# Altium project TIDA_00620.PrjPcb (part 4 of 8)
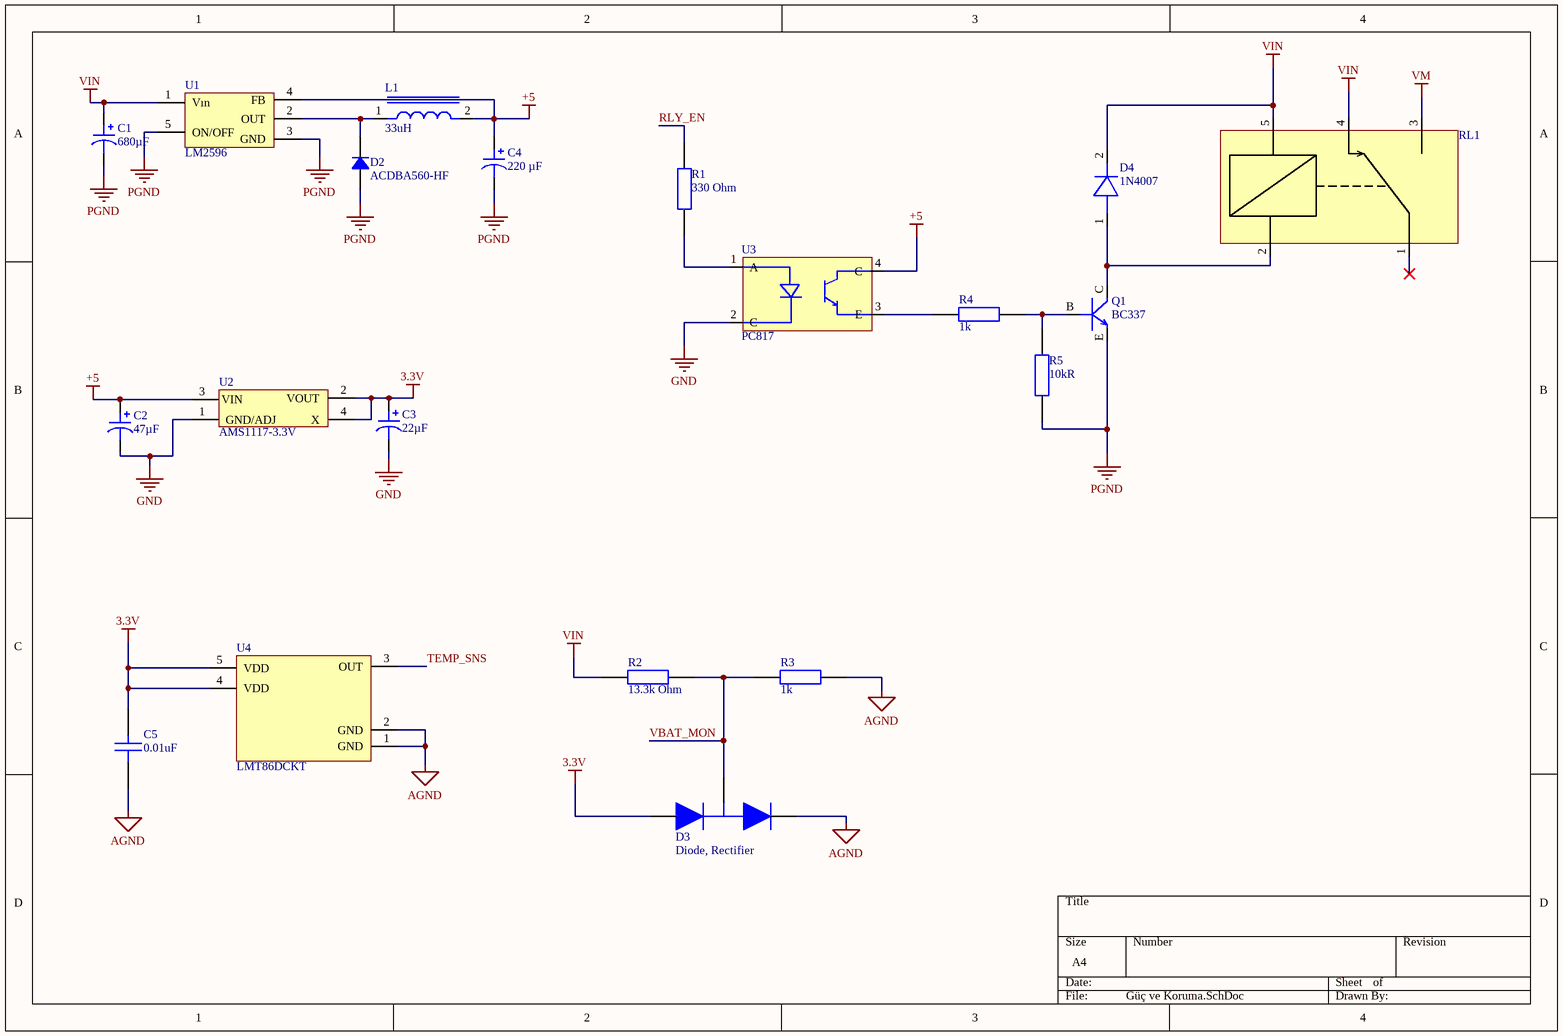
[diagram p7: Güç ve Koruma.SchDoc]

## Sheet Güç ve Koruma.SchDoc (continued)
### Library data of the parts
C1 = EEU-FC1H681L: CAP ALUM 680UF 20% 50V RADIAL; manufacturer: Panasonic Electronic Components; Impedance: 40 mOhms; Lifetime @ Temp.: 5000 Hrs @ 105°C; Polarization: Polar; Ripple Current @ High Frequency: 2.215A @ 100kHz; Ripple Current @ Low Frequency: 1.661A @ 120Hz; Part Number: EEU-FC1H681L; Applications: Automotive; Capacitance: 680µF; componentlink1description: Datasheet; componentlink1url: http://industrial.panasonic.com/www-cgi/jvcr13pz.cgi?E+PZ+3+ABA0022+EEUFC1H681L+7+WW; componentlink2description: DigiKey Link; componentlink2url: http://digikey.com/product-detail/en/panasonic-electronic-components/EEU-FC1H681L/P10330-ND/266339; Device Package: Radial, Can; Height - Seated (Max): 1.181" (30.00mm); lastupdated: 2.09.2020 01:32:17; Lead Spacing: 0.197" (5.00mm); Lifecycle Status: Active; Minimum Order: 1; Mounting Type: Through Hole; Operating Temperature: -55°C ~ 105°C; Package / Case: Radial, Can; packaging: Bulk; partid: 15369; Part Status: Active; price: 1.02; Ratings: AEC-Q200; series: FC; Size / Dimension: 0.492" Dia (12.50mm); Supplier 1: DigiKey; Supplier Part Number 1: P10330-ND; Tolerance: ±20%; value: 680µF; Voltage - Rated: 50V
C2 = UMF1C470MDD: CAP ALUM 47UF 20% 16V RADIAL; manufacturer: Nichicon; Impedance: 1.3 Ohms; Lifetime @ Temp.: 1000 Hrs @ 105°C; Polarization: Polar; Ripple Current @ High Frequency: 115mA @ 100kHz; Ripple Current @ Low Frequency: 57.5mA @ 120Hz; Part Number: UMF1C470MDD; Applications: General Purpose; Capacitance: 47µF; componentlink1description: Datasheet; componentlink1url: http://nichicon-us.com/english/products/pdfs/e-umf.pdf; componentlink2description: DigiKey Link; componentlink2url: http://digikey.com/product-detail/en/nichicon/UMF1C470MDD/493-15537-ND/2598659; Device Package: Radial, Can; Height - Seated (Max): 0.236" (6.00mm); lastupdated: 4.09.2020 01:05:49; Lead Spacing: 0.098" (2.50mm); Lifecycle Status: Active; Minimum Order: 1; Mounting Type: Through Hole; Operating Temperature: -55°C ~ 105°C; Package / Case: Radial, Can; packaging: Bulk; partid: 20736; Part Status: Active; price: 0.43; series: UMF; Size / Dimension: 0.248" Dia (6.30mm); Supplier 1: DigiKey; Supplier Part Number 1: 493-15537-ND; Tolerance: ±20%; value: 47µF; Voltage - Rated: 16V
C3 = UES1C220MEM1TD: CAP ALUM 22UF 20% 16V RADIAL; manufacturer: Nichicon; Lifetime @ Temp.: 1000 Hrs @ 85°C; Polarization: Bi-Polar; Part Number: UES1C220MEM1TD; Applications: Audio; Capacitance: 22µF; componentlink1description: Datasheet; componentlink1url: http://nichicon-us.com/english/products/pdfs/e-ues.pdf; componentlink2description: DigiKey Link; componentlink2url: http://digikey.com/product-detail/en/nichicon/UES1C220MEM1TD/493-10818-1-ND/4317793; Device Package: Radial, Can; Height - Seated (Max): 0.472" (12.00mm); lastupdated: 4.09.2020 01:05:44; Lead Spacing: 0.098" (2.50mm); Lifecycle Status: Active; Minimum Order: 1; Mounting Type: Through Hole; Operating Temperature: -40°C ~ 85°C; Package / Case: Radial, Can; packaging: TapeAndBox; partid: 20107; Part Status: Active; price: 0.13; series: UES; Size / Dimension: 0.248" Dia (6.30mm); Supplier 1: DigiKey; Supplier Part Number 1: 493-10818-1-ND; Tolerance: ±20%; value: 22µF; Voltage - Rated: 16V
C4 = ESW227M025AG3AA: CAP ALUM 220UF 20% 25V RADIAL; manufacturer: KEMET; ESR (Equivalent Series Resistance): 130mOhm @ 100kHz; Impedance: 117 mOhms; Lifetime @ Temp.: 4000 Hrs @ 105°C; Polarization: Polar; Ripple Current @ High Frequency: 640 mA @ 100 kHz; Ripple Current @ Low Frequency: 320 mA @ 120 Hz; Part Number: ESW227M025AG3AA; Applications: General Purpose; Capacitance: 220 µF; componentlink1description: Datasheet; componentlink1url: https://api.kemet.com/component-edge/download/datasheet/ESW227M025AG3AA.pdf; componentlink2description: DigiKey Link; componentlink2url: https://www.digikey.com/en/products/detail/kemet/ESW227M025AG3AA/2712542; Device Package: Radial, Can; Height - Seated (Max): 0.492" (12.50mm); lastupdated: 3.06.2024 20:06:12; Lead Spacing: 0.138" (3.50mm); Lifecycle Status: Active; Minimum Order: 1; Mounting Type: Through Hole; Operating Temperature: -40°C ~ 105°C; Package / Case: Radial, Can; packaging: Bulk; partid: 7223; Part Status: Active; price: 0.10; series: ESW; Size / Dimension: 0.315" Dia (8.00mm); Supplier 1: DigiKey; Supplier Part Number 1: 399-6112-ND; Tolerance: ±20%; value: 220 µF; Voltage - Rated: 25 V
C5 = GRM188R70J103KA01D: CAP CER 10000PF 6.3V X7R 0603; Manufacturer: Murata; Tolerance: ±10%; Capacitance: 10000 pF; Voltage - Rated: 6.3V; Package / Case: 0603 (1608 Metric)
D2 = ACDBA560-HF: DIODE SCHOTTKY 60V 5A DO214AC; Manufacturer: Comchip Technology; Capacitance @ Vr, F: 250pF @ 4V, 1MHz; Current - Reverse Leakage @ Vr: 500 µA @ 60 V; Speed: Fast Recovery =< 500ns, > 200mA (Io); Voltage - Forward (Vf) (Max) @ If: 700 mV @ 5 A; Part Number: ACDBA560-HF; ComponentLink1Description: Datasheet; ComponentLink1URL: http://www.comchiptech.com/admin/files/product/ACDBA560-HF%20RevA201382.pdf; ComponentLink2Description: DigiKey Link; ComponentLink2URL: https://www.digikey.com/en/products/detail/comchip-technology/ACDBA560-HF/7100903; Current - Average Rectified (Io): 5A; Diode Type: Schottky; LastUpdated: 3.06.2024 19:54:37; Lifecycle Status: Active; Minimum Order: 1; Mounting Type: Surface Mount; Operating Temperature - Junction: -55°C ~ 125°C; Package / Case: DO-214AC, SMA; Packaging: TapeAndReel; PartId: 1832; Part Status: Active; Price: 0.15; Series: -; Supplier 1: DigiKey; Supplier Part Number 1: 641-2078-1-ND; Supplier Device Package: DO-214AC (SMA); Voltage - DC Reverse (Vr) (Max): 60 V
D3 = MMBD7000LT1G: Diode, Rectifier, Switching, Vr 100VDC, If 200MA, Pkg SOT-23 (TO-236AB), Config Dual; Manufacturer: onsemi; Manufacturer Lifecycle Status: ACTIVE; Value: 1.5pF; Element Configuration: Common Cathode; Forward Voltage: 1.1V; Max Forward Surge Current (Ifsm): 1.6A; Max Junction Temperature (Tj): 150°C; Max Power Dissipation: 225mW; Max Repetitive Reverse Voltage (Vrrm): 100V; Max Reverse Leakage Current: 3µA; Max Surge Current: 500mA; Number of Elements: 2; Power Dissipation: 300mW; Recovery Time: 4ns; Supplier: Future Electronics; Supplier Part Number: 9072660; Manufacturer Part Number: MMBD7000LT1G; RoHS: Compliant; Category: Rectifier Diodes; Stock: 3288000; Pricing: 3000=0,017, 9000=0,0166, 15000=0,0164, 60000=0,0159, 90000=0,0156 (USD); Average Rectified Current: 200mA; Case/Package: SOT-23; China RoHS: Compliant; Contact Plating: Tin; Current Rating: 200mA; Forward Current: 200mA; Halogen Free: Halogen Free; Height: 1.11mm; Lead Free: Lead Free; Length: 2.9mm; Lifecycle Status: Production; Max Operating Temperature: 150°C; Max Output current: 200mA; Max Reverse Voltage (DC): 100V; Min Operating Temperature: -55°C; Pins: 3; Number of Terminals: 3; Packaging: Tape and Reel; Peak Non-Repetitive Surge Current: 500mA; Peak Reverse Current: 3µA; Radiation Hardening: No; REACH SVHC: Yes; Reverse Recovery Time: 4ns; Reverse Standoff Voltage: 100V; Reverse Voltage: 100V; Schedule B: 8541100070, 8541100070|8541100070|8541100070|8541100070|8541100070; Voltage Rating (DC): 100V; Width: 1.3mm; ComponentLink1URL: https://datasheet.octopart.com:443/MMBD7000LT1G-onsemi-datasheet-180963513.pdf?src-supplier=IHS; ComponentLink1Description: https://datasheet.octopart.com:443/MMBD7000LT1G-onsemi-datasheet-180963513.pdf?src-supplier=IHS; ComponentLink2URL: https://datasheet.octopart.com:443/MMBD7000LT1G-ON-Semiconductor-datasheet-93401931.pdf?src-supplier=Newark; ComponentLink2Description: https://datasheet.octopart.com:443/MMBD7000LT1G-ON-Semiconductor-datasheet-93401931.pdf?src-supplier=Newark; ComponentLink3URL: https://datasheet.octopart.com:443/MMBD7000LT1G-ON-Semiconductor-datasheet-11974380.pdf?src-supplier=Newark; ComponentLink3Description: https://datasheet.octopart.com:443/MMBD7000LT1G-ON-Semiconductor-datasheet-11974380.pdf?src-supplier=Newark; ComponentLink4URL: https://datasheet.octopart.com:443/MMBD7000LT1G-ON-Semiconductor-datasheet-8327385.pdf?src-supplier=Newark; ComponentLink4Description: https://datasheet.octopart.com:443/MMBD7000LT1G-ON-Semiconductor-datasheet-8327385.pdf?src-supplier=Newark; ComponentLink5URL: https://datasheet.octopart.com:443/MMBD7000LT1G-ON-Semiconductor-datasheet-7594318.pdf?src-supplier=Newark; ComponentLink5Description: https://datasheet.octopart.com:443/MMBD7000LT1G-ON-Semiconductor-datasheet-7594318.pdf?src-supplier=Newark; ComponentLink6URL: https://sigma.octopart.com:443/138897241/technical_drawing/ON-Semiconductor-MMBD7000LT1G.pdf?src-supplier=Upverter; ComponentLink6Description: https://sigma.octopart.com:443/138897241/technical_drawing/ON-Semiconductor-MMBD7000LT1G.pdf?src-supplier=Upverter; ComponentLink7URL: https://datasheet.octopart.com:443/MMBD7000LT1G-ON-Semiconductor-datasheet-14052313.pdf?src-supplier=iiiC; ComponentLink7Description: https://datasheet.octopart.com:443/MMBD7000LT1G-ON-Semiconductor-datasheet-14052313.pdf?src-supplier=iiiC; ComponentLink8URL: https://datasheet.octopart.com:443/MMBD7000LT1G-ON-Semiconductor-datasheet-9951378.pdf?src-supplier=RS+(Formerly+Allied+Electronics); ComponentLink8Description: https://datasheet.octopart.com:443/MMBD7000LT1G-ON-Semiconductor-datasheet-9951378.pdf?src-supplier=RS+(Formerly+Allied+Electronics); ComponentLink9URL: http://sigma.octopart.com:80/15540786/rohs_certificate/ON-Semiconductor-MMBD7000LT1G.pdf?src-supplier=Compliance+Statements; ComponentLink9Description: http://sigma.octopart.com:80/15540786/rohs_certificate/ON-Semiconductor-MMBD7000LT1G.pdf?src-supplier=Compliance+Statements; ComponentLink10URL: http://sigma.octopart.com:80/15680733/materials_sheet/ON-Semiconductor-MMBD7000LT1G.csv?src-supplier=Compliance+Statements; ComponentLink10Description: http://sigma.octopart.com:80/15680733/materials_sheet/ON-Semiconductor-MMBD7000LT1G.csv?src-supplier=Compliance+Statements; ComponentLink11URL: http://sigma.octopart.com:80/150618295/rohs_statement/ON-Semiconductor-MMBD7000LT1G.pdf?src-supplier=Compliance+Statements; ComponentLink11Description: http://sigma.octopart.com:80/150618295/rohs_statement/ON-Semiconductor-MMBD7000LT1G.pdf?src-supplier=Compliance+Statements; ComponentLink12URL: http://sigma.octopart.com:80/reach_statement/ON-Semiconductor-company-79.pdf?src-supplier=Compliance+Statements; ComponentLink12Description: http://sigma.octopart.com:80/reach_statement/ON-Semiconductor-company-79.pdf?src-supplier=Compliance+Statements; ComponentLink13URL: https://octopart.com:443/opatz8j6/c1?t=fJzi0fIB4MdtCKTN66uwhwNTDQrl0R6yc-1-o3J3PffONZWqkIMU2L6fpiOR1oZSET9f3sqQd7ykmPSoW81IbVPyVBFwBUdoF7sQArq84QgRXK9HCf9McP42Xxbn8aEVplU8K_KhDjglBkkd9-zc6p6-CJ9lKtUv1E-pLWoCkW-rqVYkDrRqY25a9IANyKSZPTXd9uYNFNsED4muOrsd3TsRENCZ-qK4VhaX_vUYcK9Gw4t3xLVeKujJSZ8XqnAeUNLu-KLCkd9ZYDHLxs26vmVP-01owMmpb_Xcng6l6BxctXB2teJ_8DlD7F4xEPdo8zgBrTChEy1yUUAOwSlcpT_LSdYnlYZv39SBVKs&src-supplier=Compliance+Statements; ComponentLink13Description: https://octopart.com:443/opatz8j6/c1?t=fJzi0fIB4MdtCKTN66uwhwNTDQrl0R6yc-1-o3J3PffONZWqkIMU2L6fpiOR1oZSET9f3sqQd7ykmPSoW81IbVPyVBFwBUdoF7sQArq84QgRXK9HCf9McP42Xxbn8aEVplU8K_KhDjglBkkd9-zc6p6-CJ9lKtUv1E-pLWoCkW-rqVYkDrRqY25a9IANyKSZPTXd9uYNFNsED4muOrsd3TsRENCZ-qK4VhaX_vUYcK9Gw4t3xLVeKujJSZ8XqnAeUNLu-KLCkd9ZYDHLxs26vmVP-01owMmpb_Xcng6l6BxctXB2teJ_8DlD7F4xEPdo8zgBrTChEy1yUUAOwSlcpT_LSdYnlYZv39SBVKs&src-supplier=Compliance+Statements; ComponentLink14URL: https://octopart.com:443/opatz8j6/c1?t=N1jse5SDITeLKb_wvSGF9pa6jKWEWkAYcFkkpAAnHV3Vd79y8qUbk5HCcoRESrSHu0Hyq0nMkTrSwGQAhCOn-sO9n9VDx1ewvH57BqoORsnXpb25gl-_AjQY-smkuij4PA4eRxvb_RCv93MKZ9Ayiv5bTIDtF7Et_qmDJv7nxzNpTsdL9uERhEolYwlUZk5v09syotKZOBVVkeuv1k5jdyjjxQJtg-x9fTcqpHW1a23nLFAPrYvSi-TMoWBDYTPh0VDbIfZtVfwDxSiOW63Td902C2qC70cSuDqU3YJEUzhtCEuMvYss7Cpx9wprQ9E-CsJYJDMS9SAJ1G0zDb4qiRBmVF2PUnPvWq_yzw&src-supplier=Compliance+Statements; ComponentLink14Description: https://octopart.com:443/opatz8j6/c1?t=N1jse5SDITeLKb_wvSGF9pa6jKWEWkAYcFkkpAAnHV3Vd79y8qUbk5HCcoRESrSHu0Hyq0nMkTrSwGQAhCOn-sO9n9VDx1ewvH57BqoORsnXpb25gl-_AjQY-smkuij4PA4eRxvb_RCv93MKZ9Ayiv5bTIDtF7Et_qmDJv7nxzNpTsdL9uERhEolYwlUZk5v09syotKZOBVVkeuv1k5jdyjjxQJtg-x9fTcqpHW1a23nLFAPrYvSi-TMoWBDYTPh0VDbIfZtVfwDxSiOW63Td902C2qC70cSuDqU3YJEUzhtCEuMvYss7Cpx9wprQ9E-CsJYJDMS9SAJ1G0zDb4qiRBmVF2PUnPvWq_yzw&src-supplier=Compliance+Statements
D4 = 1N4007: Rectifier Diode, 1 Phase, 1 Element, 1A, 1000V V(RRM), Silicon, DO-204AC; Manufacturer: Diotec; Manufacturer Lifecycle Status: ACTIVE; Value: 15pF; Element Configuration: Single; Forward Voltage: 1V; Max Forward Surge Current (Ifsm): 30A; Max Junction Temperature (Tj): 175°C; Max Repetitive Reverse Voltage (Vrrm): 1kV; Max Surge Current: 27A; Number of Elements: 1; Peak Reverse Current: 5µA; Polarity: Standard; Reverse Recovery Time: 1.5µs; Supplier: Mouser; Supplier Part Number: 637-1N4007; Manufacturer Part Number: 1N4007; RoHS: Compliant; Category: Rectifier Diodes; Stock: 355273; Pricing: 1=0,13, 10=0,084, 50=0,084, 100=0,057, 1000=0,036, 10000=0,019 (USD); Case/Package: Axial; Forward Current: 1A; Height: 2.8mm; Harmonized Tariff Schedule (HTS) Code: 85411000; Lifecycle Status: Production; Max Operating Temperature: 175°C; Max Output current: 1A; Min Operating Temperature: -50°C; Mounting Technology: Axial; Pins: 2; Number of Terminals: 2; Peak Non-Repetitive Surge Current: 30A; REACH SVHC: Unknown; Reverse Standoff Voltage: 1kV; Reverse Voltage: 1kV; Weight: 300mg; ComponentLink1URL: https://datasheet.octopart.com:443/1N4007-Diotec-datasheet-180572013.pdf?src-supplier=IHS; ComponentLink1Description: https://datasheet.octopart.com:443/1N4007-Diotec-datasheet-180572013.pdf?src-supplier=IHS; ComponentLink2URL: https://datasheet.octopart.com:443/1N4007-Diotec-datasheet-180725457.pdf?src-supplier=IHS; ComponentLink2Description: https://datasheet.octopart.com:443/1N4007-Diotec-datasheet-180725457.pdf?src-supplier=IHS; ComponentLink3URL: https://datasheet.octopart.com:443/1N4007-Diotec-datasheet-182232370.pdf?src-supplier=IHS; ComponentLink3Description: https://datasheet.octopart.com:443/1N4007-Diotec-datasheet-182232370.pdf?src-supplier=IHS; ComponentLink4URL: https://datasheet.octopart.com:443/1N4007-Diotec-datasheet-180570705.pdf?src-supplier=IHS; ComponentLink4Description: https://datasheet.octopart.com:443/1N4007-Diotec-datasheet-180570705.pdf?src-supplier=IHS; ComponentLink5URL: https://datasheet.octopart.com:443/1N4007-Diotec-datasheet-62346875.pdf?src-supplier=Burklin+Elektronik; ComponentLink5Description: https://datasheet.octopart.com:443/1N4007-Diotec-datasheet-62346875.pdf?src-supplier=Burklin+Elektronik; ComponentLink6URL: https://datasheet.octopart.com:443/1N4007-Diotec-datasheet-168809440.pdf?src-supplier=Diotec; ComponentLink6Description: https://datasheet.octopart.com:443/1N4007-Diotec-datasheet-168809440.pdf?src-supplier=Diotec; ComponentLink7URL: https://datasheet.octopart.com:443/1N4007-Diotec-datasheet-114842631.pdf?src-supplier=SOS+electronic; ComponentLink7Description: https://datasheet.octopart.com:443/1N4007-Diotec-datasheet-114842631.pdf?src-supplier=SOS+electronic; ComponentLink8URL: https://datasheet.octopart.com:443/1N4007-Galaxy-Semiconductor-datasheet-20771558.pdf?src-supplier=TME; ComponentLink8Description: https://datasheet.octopart.com:443/1N4007-Galaxy-Semiconductor-datasheet-20771558.pdf?src-supplier=TME; ComponentLink9URL: https://datasheet.octopart.com:443/1N4007-Diotec-datasheet-118605333.pdf?src-supplier=TME; ComponentLink9Description: https://datasheet.octopart.com:443/1N4007-Diotec-datasheet-118605333.pdf?src-supplier=TME; ComponentLink10URL: https://datasheet.octopart.com:443/1N4007-Diotec-datasheet-159114366.pdf?src-supplier=TME; ComponentLink10Description: https://datasheet.octopart.com:443/1N4007-Diotec-datasheet-159114366.pdf?src-supplier=TME; ComponentLink11URL: https://datasheet.octopart.com:443/1N4007-Diotec-datasheet-189099566.pdf?src-supplier=Master+Electronics; ComponentLink11Description: https://datasheet.octopart.com:443/1N4007-Diotec-datasheet-189099566.pdf?src-supplier=Master+Electronics
L1 = CAP33uH: Inductor Power Shielded Wirewound 33uH 20% 1KHz 27Q-Factor Ferrite 3A 60mOhm DCR T/R; Manufacturer: Bourns; Manufacturer Part Number: SRR1260-330M; DC Resistance (DCR): 60mΩ; Value: 33µH; Number of Circuits: 1; Q Factor: 27; Self Resonant Frequency: 9.97MHz; Shielding: Yes; Supplier: Farnell; Supplier Part Number: 2859170; RoHS: Compliant; Category: Fixed Inductors; Stock: 6737; Pricing: 1=0,97, 10=0,797, 50=0,765, 100=0,626, 200=0,579, 600=0,531 (EUR); China RoHS: Compliant; Core Material: Ferrite; Current Rating: 3A; Height: 6mm; Inductance Tolerance: 20%; Lifecycle Status: Production; Max Current Rating: 3A; Max Operating Temperature: 125°C; Min Operating Temperature: -40°C; Pins: 2; Number of Terminals: 2; Packaging: Tape & Reel; REACH SVHC: Yes; Schedule B: 8504500000, 8504500000|8504500000, 8504500000|8504500000|8504500000, 8504500000|8504500000|8504500000|8504500000; Test Frequency: 1kHz; Tolerance: 20%; Width: 12.5mm; ComponentLink1URL: https://datasheet.octopart.com:443/SRR1260-330M-Bourns-datasheet-165058512.pdf?src-supplier=IHS; ComponentLink1Description: https://datasheet.octopart.com:443/SRR1260-330M-Bourns-datasheet-165058512.pdf?src-supplier=IHS; ComponentLink2URL: https://datasheet.octopart.com:443/SRR1260-330M-Bourns-datasheet-10635436.pdf?src-supplier=Farnell; ComponentLink2Description: https://datasheet.octopart.com:443/SRR1260-330M-Bourns-datasheet-10635436.pdf?src-supplier=Farnell; ComponentLink3URL: https://datasheet.octopart.com:443/SRR1260-330M-Bourns-datasheet-104271399.pdf?src-supplier=Farnell; ComponentLink3Description: https://datasheet.octopart.com:443/SRR1260-330M-Bourns-datasheet-104271399.pdf?src-supplier=Farnell; ComponentLink4URL: https://datasheet.octopart.com:443/SRR1260-330M-Bourns-datasheet-41191777.pdf?src-supplier=Electro+Sonic; ComponentLink4Description: https://datasheet.octopart.com:443/SRR1260-330M-Bourns-datasheet-41191777.pdf?src-supplier=Electro+Sonic; ComponentLink5URL: https://datasheet.octopart.com:443/SRR1260-330M-Bourns-datasheet-154729982.pdf?src-supplier=Electro+Sonic; ComponentLink5Description: https://datasheet.octopart.com:443/SRR1260-330M-Bourns-datasheet-154729982.pdf?src-supplier=Electro+Sonic; ComponentLink6URL: https://datasheet.octopart.com:443/SRR1260-330M-Bourns-datasheet-78856879.pdf?src-supplier=element14+APAC; ComponentLink6Description: https://datasheet.octopart.com:443/SRR1260-330M-Bourns-datasheet-78856879.pdf?src-supplier=element14+APAC; ComponentLink7URL: https://datasheet.octopart.com:443/SRR1260-330M-Bourns-datasheet-531572.pdf?src-supplier=element14; ComponentLink7Description: https://datasheet.octopart.com:443/SRR1260-330M-Bourns-datasheet-531572.pdf?src-supplier=element14; ComponentLink8URL: https://datasheet.octopart.com:443/SRR1260-330M-Bourns-datasheet-95952708.pdf?src-supplier=Burklin+Elektronik; ComponentLink8Description: https://datasheet.octopart.com:443/SRR1260-330M-Bourns-datasheet-95952708.pdf?src-supplier=Burklin+Elektronik; ComponentLink9URL: https://datasheet.octopart.com:443/SRR1260-330M-Bourns-datasheet-15703909.pdf?src-supplier=RS+(Formerly+Allied+Electronics); ComponentLink9Description: https://datasheet.octopart.com:443/SRR1260-330M-Bourns-datasheet-15703909.pdf?src-supplier=RS+(Formerly+Allied+Electronics); ComponentLink10URL: http://sigma.octopart.com:80/conflict_mineral_statement/Bourns-company-36.pdf?src-supplier=Compliance+Statements; ComponentLink10Description: http://sigma.octopart.com:80/conflict_mineral_statement/Bourns-company-36.pdf?src-supplier=Compliance+Statements
Q1 = BC337: Small Signal Bipolar Transistor, 0.8A I(C), 45V V(BR)CEO, 1-Element, NPN, Silicon, TO-92; Manufacturer: onsemi; Manufacturer Part Number: BC33725TA; Manufacturer Lifecycle Status: ACTIVE; Collector Emitter Saturation Voltage: 700mV; Element Configuration: Single; Emitter Base Voltage (VEBO): 5V; Frequency: 100MHz; hFE Min: 160; Max Collector Current: 800mA; Max Junction Temperature (Tj): 150°C; Max Power Dissipation: 625mW; Number of Elements: 1; Supplier: Future Electronics; Supplier Part Number: 5194590; RoHS: Compliant; Category: BJTs; Stock: 472000; Pricing: 2000=0,0373, 6000=0,0363, 10000=0,0359, 20000=0,0353, 40000=0,0344 (USD); Case/Package: TO-92; China RoHS: Compliant; Collector Emitter Breakdown Voltage: 45V; Collector Emitter Voltage (VCEO): 45V; Contact Plating: Tin; Gain Bandwidth Product: 100MHz; Height: 8.77mm; Lead Free: Lead Free; Length: 5.2mm; Lifecycle Status: Production; Max Breakdown Voltage: 45V; Clock Frequency: 100MHz; Max Operating Temperature: 150°C; Min Operating Temperature: -55°C; Mounting Technology: Through Hole; Pins: 3; Number of Terminals: 3; Polarity: NPN; Power Dissipation: 625mW; Radiation Hardening: No; REACH SVHC: Yes; Schedule B: 8541210080, 8541210080|8541210080, 8541210080|8541210080|8541210080, 8541210080|8541210080|8541210080|8541210080; Transition Frequency: 100MHz; Weight: 240mg; Width: 4.19mm; ComponentLink1URL: https://datasheet.octopart.com:443/BC33725TA-ON-Semiconductor-datasheet-137315713.pdf?src-supplier=JRH+Electronics; ComponentLink1Description: https://datasheet.octopart.com:443/BC33725TA-ON-Semiconductor-datasheet-137315713.pdf?src-supplier=JRH+Electronics; ComponentLink2URL: https://datasheet.octopart.com:443/BC33725TA-onsemi-datasheet-180957929.pdf?src-supplier=IHS; ComponentLink2Description: https://datasheet.octopart.com:443/BC33725TA-onsemi-datasheet-180957929.pdf?src-supplier=IHS; ComponentLink3URL: https://datasheet.octopart.com:443/BC33725TA-Fairchild-Semiconductor-datasheet-49270557.pdf?src-supplier=IHS; ComponentLink3Description: https://datasheet.octopart.com:443/BC33725TA-Fairchild-Semiconductor-datasheet-49270557.pdf?src-supplier=IHS; ComponentLink4URL: https://datasheet.octopart.com:443/BC33725TA-ON-Semiconductor-datasheet-13072.pdf?src-supplier=Fairchild+Semiconductor; ComponentLink4Description: https://datasheet.octopart.com:443/BC33725TA-ON-Semiconductor-datasheet-13072.pdf?src-supplier=Fairchild+Semiconductor; ComponentLink5URL: https://datasheet.octopart.com:443/BC33725TA-Fairchild-Semiconductor-datasheet-10379962.pdf?src-supplier=Fairchild+Semiconductor; ComponentLink5Description: https://datasheet.octopart.com:443/BC33725TA-Fairchild-Semiconductor-datasheet-10379962.pdf?src-supplier=Fairchild+Semiconductor; ComponentLink6URL: https://sigma.octopart.com:443/33035202/technical_drawing/Fairchild-Semiconductor-BC33725TA.pdf?src-supplier=Fairchild+Semiconductor; ComponentLink6Description: https://sigma.octopart.com:443/33035202/technical_drawing/Fairchild-Semiconductor-BC33725TA.pdf?src-supplier=Fairchild+Semiconductor; ComponentLink7URL: https://sigma.octopart.com:443/17343939/technical_drawing/Fairchild-Semiconductor-BC33725TA.pdf?src-supplier=Fairchild+Semiconductor; ComponentLink7Description: https://sigma.octopart.com:443/17343939/technical_drawing/Fairchild-Semiconductor-BC33725TA.pdf?src-supplier=Fairchild+Semiconductor; ComponentLink8URL: https://datasheet.octopart.com:443/BC33725TA-ON-Semiconductor-datasheet-8330525.pdf?src-supplier=onsemi; ComponentLink8Description: https://datasheet.octopart.com:443/BC33725TA-ON-Semiconductor-datasheet-8330525.pdf?src-supplier=onsemi; ComponentLink9URL: https://datasheet.octopart.com:443/BC33725TA-ON-Semiconductor-datasheet-498802.pdf?src-supplier=onsemi; ComponentLink9Description: https://datasheet.octopart.com:443/BC33725TA-ON-Semiconductor-datasheet-498802.pdf?src-supplier=onsemi; ComponentLink10URL: https://datasheet.octopart.com:443/BC33725TA-ON-Semiconductor-datasheet-86688491.pdf?src-supplier=onsemi; ComponentLink10Description: https://datasheet.octopart.com:443/BC33725TA-ON-Semiconductor-datasheet-86688491.pdf?src-supplier=onsemi; ComponentLink11URL: https://datasheet.octopart.com:443/BC33725TA-ON-Semiconductor-datasheet-94100688.pdf?src-supplier=element14+APAC; ComponentLink11Description: https://datasheet.octopart.com:443/BC33725TA-ON-Semiconductor-datasheet-94100688.pdf?src-supplier=element14+APAC; ComponentLink12URL: https://datasheet.octopart.com:443/BC33725TA-onsemi-datasheet-34433467.pdf?src-supplier=Farnell; ComponentLink12Description: https://datasheet.octopart.com:443/BC33725TA-onsemi-datasheet-34433467.pdf?src-supplier=Farnell; ComponentLink13URL: https://datasheet.octopart.com:443/BC33725TA-ON-Semiconductor-datasheet-86684068.pdf?src-supplier=Farnell; ComponentLink13Description: https://datasheet.octopart.com:443/BC33725TA-ON-Semiconductor-datasheet-86684068.pdf?src-supplier=Farnell; ComponentLink14URL: https://datasheet.octopart.com:443/BC33725TA-Fairchild-Semiconductor-datasheet-38327704.pdf?src-supplier=Farnell; ComponentLink14Description: https://datasheet.octopart.com:443/BC33725TA-Fairchild-Semiconductor-datasheet-38327704.pdf?src-supplier=Farnell; ComponentLink15URL: https://datasheet.octopart.com:443/BC33725TA-Fairchild-Semiconductor-datasheet-41473365.pdf?src-supplier=Farnell; ComponentLink15Description: https://datasheet.octopart.com:443/BC33725TA-Fairchild-Semiconductor-datasheet-41473365.pdf?src-supplier=Farnell; ComponentLink16URL: https://datasheet.octopart.com:443/BC33725TA-Fairchild-datasheet-7627855.pdf?src-supplier=Jameco; ComponentLink16Description: https://datasheet.octopart.com:443/BC33725TA-Fairchild-datasheet-7627855.pdf?src-supplier=Jameco; ComponentLink17URL: https://datasheet.octopart.com:443/BC33725TA-ON-Semiconductor-datasheet-147640423.pdf?src-supplier=Jameco; ComponentLink17Description: https://datasheet.octopart.com:443/BC33725TA-ON-Semiconductor-datasheet-147640423.pdf?src-supplier=Jameco; ComponentLink18URL: https://datasheet.octopart.com:443/BC33725TA-ON-Semiconductor-datasheet-44607075.pdf?src-supplier=Newark; ComponentLink18Description: https://datasheet.octopart.com:443/BC33725TA-ON-Semiconductor-datasheet-44607075.pdf?src-supplier=Newark; ComponentLink19URL: https://datasheet.octopart.com:443/BC33725TA-Fairchild-Semiconductor-datasheet-33192856.pdf?src-supplier=Newark; ComponentLink19Description: https://datasheet.octopart.com:443/BC33725TA-Fairchild-Semiconductor-datasheet-33192856.pdf?src-supplier=Newark; ComponentLink20URL: https://datasheet.octopart.com:443/BC33725TA-ON-Semiconductor-datasheet-81454738.pdf?src-supplier=TME; ComponentLink20Description: https://datasheet.octopart.com:443/BC33725TA-ON-Semiconductor-datasheet-81454738.pdf?src-supplier=TME; ComponentLink21URL: http://sigma.octopart.com:80/150605282/rohs_statement/ON-Semiconductor-BC33725TA.pdf?src-supplier=Compliance+Statements; ComponentLink21Description: http://sigma.octopart.com:80/150605282/rohs_statement/ON-Semiconductor-BC33725TA.pdf?src-supplier=Compliance+Statements; ComponentLink22URL: http://sigma.octopart.com:80/23426707/materials_sheet/Fairchild-Semiconductor-BC33725TA.pdf?src-supplier=Compliance+Statements; ComponentLink22Description: http://sigma.octopart.com:80/23426707/materials_sheet/Fairchild-Semiconductor-BC33725TA.pdf?src-supplier=Compliance+Statements; ComponentLink23URL: http://sigma.octopart.com:80/23426706/rohs_statement/Fairchild-Semiconductor-BC33725TA.pdf?src-supplier=Compliance+Statements; ComponentLink23Description: http://sigma.octopart.com:80/23426706/rohs_statement/Fairchild-Semiconductor-BC33725TA.pdf?src-supplier=Compliance+Statements; ComponentLink24URL: http://sigma.octopart.com:80/33052040/reach_statement/Fairchild-Semiconductor-BC33725TA.pdf?src-supplier=Compliance+Statements; ComponentLink24Description: http://sigma.octopart.com:80/33052040/reach_statement/Fairchild-Semiconductor-BC33725TA.pdf?src-supplier=Compliance+Statements; ComponentLink25URL: http://sigma.octopart.com:80/33052160/materials_sheet/Fairchild-Semiconductor-BC33725TA.pdf?src-supplier=Compliance+Statements; ComponentLink25Description: http://sigma.octopart.com:80/33052160/materials_sheet/Fairchild-Semiconductor-BC33725TA.pdf?src-supplier=Compliance+Statements; ComponentLink26URL: http://sigma.octopart.com:80/reach_statement/ON-Semiconductor-company-79.pdf?src-supplier=Compliance+Statements; ComponentLink26Description: http://sigma.octopart.com:80/reach_statement/ON-Semiconductor-company-79.pdf?src-supplier=Compliance+Statements; ComponentLink27URL: http://sigma.octopart.com:80/rohs_statement/Fairchild-Semiconductor-company-11.pdf?src-supplier=Compliance+Statements; ComponentLink27Description: http://sigma.octopart.com:80/rohs_statement/Fairchild-Semiconductor-company-11.pdf?src-supplier=Compliance+Statements; ComponentLink28URL: http://sigma.octopart.com:80/rohs_statement/Fairchild-Semiconductor-company-10.pdf?src-supplier=Compliance+Statements; ComponentLink28Description: http://sigma.octopart.com:80/rohs_statement/Fairchild-Semiconductor-company-10.pdf?src-supplier=Compliance+Statements; ComponentLink29URL: http://sigma.octopart.com:80/reach_statement/Fairchild-Semiconductor-company-9.pdf?src-supplier=Compliance+Statements; ComponentLink29Description: http://sigma.octopart.com:80/reach_statement/Fairchild-Semiconductor-company-9.pdf?src-supplier=Compliance+Statements; ComponentLink30URL: https://octopart.com:443/opatz8j6/c1?t=7tgkbhl7hNOlxvHAamqH0m269kpp9v6sGlRTOBaT6YYzEhLHvcWBeIWNMqzhK9FPZgl-AG_-qkbktRXwtanp--AFB2z5Yej5linCCK3okaZeH_qn_zjvbhtIYiaoQv1yV6MP79n_gTQ_S-gxxdk2XvXb2fzp_nw7FvZqj61EeKKpPXvGZsG0byaEmYTsEd1mEcWjFDLHcl11PSUDlHBHUFVg-qAVcNcD5KYPtuqcJCbrOVxmpG0ioK0vvHo8n0fScx4vCZ95bgvxAMgfLRrMo0yLNQdqFrCJfXJyZvuU3um222Lv7_8iKj3zKng7ZoQ4rVRgSg-F-_O3BVcDToBjHjyBtNGyDINbgkTQ&src-supplier=Compliance+Statements; ComponentLink30Description: https://octopart.com:443/opatz8j6/c1?t=7tgkbhl7hNOlxvHAamqH0m269kpp9v6sGlRTOBaT6YYzEhLHvcWBeIWNMqzhK9FPZgl-AG_-qkbktRXwtanp--AFB2z5Yej5linCCK3okaZeH_qn_zjvbhtIYiaoQv1yV6MP79n_gTQ_S-gxxdk2XvXb2fzp_nw7FvZqj61EeKKpPXvGZsG0byaEmYTsEd1mEcWjFDLHcl11PSUDlHBHUFVg-qAVcNcD5KYPtuqcJCbrOVxmpG0ioK0vvHo8n0fScx4vCZ95bgvxAMgfLRrMo0yLNQdqFrCJfXJyZvuU3um222Lv7_8iKj3zKng7ZoQ4rVRgSg-F-_O3BVcDToBjHjyBtNGyDINbgkTQ&src-supplier=Compliance+Statements; ComponentLink31URL: https://octopart.com:443/opatz8j6/c1?t=DgGuX_kL8AP-LdQEoY-gRP9PTloT94hhxKM2YdEaxOl8FGHS_zv2ZkydayasGw1YmBBlMCZlY4bKoiBWyvBUddEqcsTPjFVS2QZtk4GQF5ptMFUWJvApi1htCeSvZOrTKl36iUEfCU0GqwGxGi9_A0YgUCGuZ0ZYZwhfOZhc7Kcd2Va_E4xClJwhY6OdxEPu5b3YSjBTXFRfMrx_dG8gt7cYIFOv9W2YgN8xS8H7aXbrYgqsfjWK5lQCwPEC9eVHzi-q7-kgeRzPeyerPeCZvjlm4uBx7RbfE1Uw2dPaVjLg4Cx5JClPeS0fkHV_FO__Yf0RFH6_UrQyzMOPbf_qnsvkFbfXsTPLRL8T2g&src-supplier=Compliance+Statements; ComponentLink31Description: https://octopart.com:443/opatz8j6/c1?t=DgGuX_kL8AP-LdQEoY-gRP9PTloT94hhxKM2YdEaxOl8FGHS_zv2ZkydayasGw1YmBBlMCZlY4bKoiBWyvBUddEqcsTPjFVS2QZtk4GQF5ptMFUWJvApi1htCeSvZOrTKl36iUEfCU0GqwGxGi9_A0YgUCGuZ0ZYZwhfOZhc7Kcd2Va_E4xClJwhY6OdxEPu5b3YSjBTXFRfMrx_dG8gt7cYIFOv9W2YgN8xS8H7aXbrYgqsfjWK5lQCwPEC9eVHzi-q7-kgeRzPeyerPeCZvjlm4uBx7RbfE1Uw2dPaVjLg4Cx5JClPeS0fkHV_FO__Yf0RFH6_UrQyzMOPbf_qnsvkFbfXsTPLRL8T2g&src-supplier=Compliance+Statements
R1 = RC0603FR-07330RL: Res Thick Film 0603 330 Ohm 1% 0.1W(1/10W) ±100ppm/C Pad SMD T/R; Manufacturer: Yageo Group; Value: 47µF; ESR (Equivalent Series Resistance): 800mΩ; Max Power Dissipation: 100mW; Temperature Coefficient: 100ppm/°C; Voltage Rating: 16V; Voltage Rating (AC): 50V; Working Voltage: 75V; Supplier: Farnell; Supplier Part Number: 9238425; Manufacturer Part Number: RC0603FR-07330RL; RoHS: Compliant; Category: Chip SMD Resistors; Stock: 528709; Pricing: 10=0,0086, 100=0,0077, 500=0,0061, 1000=0,0046, 2500=0,0036 (EUR); Case/Package: 2917; Case Code (Imperial): 2917; Case Code (Metric): 7343; China RoHS: Non-Compliant; Composition: Thick Film; Depth: 800µm; Features: Moisture Resistant; Height: 450µm; Lead Free: Lead Free; Length: 7.3mm; Lifecycle Status: Production; Max Operating Temperature: 155°C; Min Operating Temperature: -55°C; Mounting Technology: Surface Mount; Pins: 2; Number of Terminals: 2; Number of Terminations: 2; Packaging: Tape and Reel; Power Dissipation: 100mW; Power Rating: 100mW; Radiation Hardening: No; REACH SVHC: Yes; Schedule B: 8533210045, 8533210045|8533210045, 8533210045|8533210045|8533210045, 8533210045|8533210045|8533210045|8533210045; Termination: SMD/SMT; Tolerance: 1%; Voltage Rating (DC): 16V; Width: 800µm; ComponentLink1URL: https://datasheet.octopart.com:443/RC0603FR-07330RL-Yageo-datasheet-175887523.pdf?src-supplier=IHS; ComponentLink1Description: https://datasheet.octopart.com:443/RC0603FR-07330RL-Yageo-datasheet-175887523.pdf?src-supplier=IHS; ComponentLink2URL: https://datasheet.octopart.com:443/RC0603FR-07330RL-Yageo-datasheet-62067350.pdf?src-supplier=Newark; ComponentLink2Description: https://datasheet.octopart.com:443/RC0603FR-07330RL-Yageo-datasheet-62067350.pdf?src-supplier=Newark; ComponentLink3URL: https://datasheet.octopart.com:443/RC0603FR-07330RL-Yageo-datasheet-12596169.pdf?src-supplier=Newark; ComponentLink3Description: https://datasheet.octopart.com:443/RC0603FR-07330RL-Yageo-datasheet-12596169.pdf?src-supplier=Newark; ComponentLink4URL: https://datasheet.octopart.com:443/RC0603FR-07330RL-Yageo-datasheet-503470.pdf?src-supplier=Newark; ComponentLink4Description: https://datasheet.octopart.com:443/RC0603FR-07330RL-Yageo-datasheet-503470.pdf?src-supplier=Newark; ComponentLink5URL: https://datasheet.octopart.com:443/RC0603FR-07330RL-Yageo-datasheet-34211833.pdf?src-supplier=Newark; ComponentLink5Description: https://datasheet.octopart.com:443/RC0603FR-07330RL-Yageo-datasheet-34211833.pdf?src-supplier=Newark; ComponentLink6URL: https://datasheet.octopart.com:443/RC0603FR-07330RL-Yageo-datasheet-103092701.pdf?src-supplier=Upverter; ComponentLink6Description: https://datasheet.octopart.com:443/RC0603FR-07330RL-Yageo-datasheet-103092701.pdf?src-supplier=Upverter; ComponentLink7URL: https://datasheet.octopart.com:443/RC0603FR-07330RL-Yageo-datasheet-98239111.pdf?src-supplier=Upverter; ComponentLink7Description: https://datasheet.octopart.com:443/RC0603FR-07330RL-Yageo-datasheet-98239111.pdf?src-supplier=Upverter; ComponentLink8URL: https://datasheet.octopart.com:443/RC0603FR-07330RL-Yageo-datasheet-8328172.pdf?src-supplier=element14+APAC; ComponentLink8Description: https://datasheet.octopart.com:443/RC0603FR-07330RL-Yageo-datasheet-8328172.pdf?src-supplier=element14+APAC; ComponentLink9URL: https://datasheet.octopart.com:443/RC0603FR-07330RL-Yageo-datasheet-15599030.pdf?src-supplier=Future+Electronics; ComponentLink9Description: https://datasheet.octopart.com:443/RC0603FR-07330RL-Yageo-datasheet-15599030.pdf?src-supplier=Future+Electronics; ComponentLink10URL: https://datasheet.octopart.com:443/RC0603FR-07330RL-Yageo-datasheet-164759695.pdf?src-supplier=Future+Electronics; ComponentLink10Description: https://datasheet.octopart.com:443/RC0603FR-07330RL-Yageo-datasheet-164759695.pdf?src-supplier=Future+Electronics; ComponentLink11URL: https://datasheet.octopart.com:443/RC0603FR-07330RL-Yageo-datasheet-137700087.pdf?src-supplier=Future+Electronics; ComponentLink11Description: https://datasheet.octopart.com:443/RC0603FR-07330RL-Yageo-datasheet-137700087.pdf?src-supplier=Future+Electronics; ComponentLink12URL: https://datasheet.octopart.com:443/RC0603FR-07330RL-Yageo-datasheet-27584510.pdf?src-supplier=Future+Electronics; ComponentLink12Description: https://datasheet.octopart.com:443/RC0603FR-07330RL-Yageo-datasheet-27584510.pdf?src-supplier=Future+Electronics; ComponentLink13URL: https://datasheet.octopart.com:443/RC0603FR-07330RL-Yageo-datasheet-8324193.pdf?src-supplier=Future+Electronics; ComponentLink13Description: https://datasheet.octopart.com:443/RC0603FR-07330RL-Yageo-datasheet-8324193.pdf?src-supplier=Future+Electronics; ComponentLink14URL: https://datasheet.octopart.com:443/RC0603FR-07330RL-Yageo-datasheet-79472498.pdf?src-supplier=Megastar; ComponentLink14Description: https://datasheet.octopart.com:443/RC0603FR-07330RL-Yageo-datasheet-79472498.pdf?src-supplier=Megastar; ComponentLink15URL: https://datasheet.octopart.com/RC0603FR-07330RL-Yageo-datasheet-73766026.pdf; ComponentLink15Description: https://datasheet.octopart.com/RC0603FR-07330RL-Yageo-datasheet-73766026.pdf; ComponentLink16URL: https://datasheet.octopart.com:443/RC0603FR-07330RL-Yageo-datasheet-13691069.pdf?src-supplier=Farnell; ComponentLink16Description: https://datasheet.octopart.com:443/RC0603FR-07330RL-Yageo-datasheet-13691069.pdf?src-supplier=Farnell; ComponentLink17URL: https://datasheet.octopart.com:443/RC0603FR-07330RL-Yageo-datasheet-118562.pdf?src-supplier=DigiKey; ComponentLink17Description: https://datasheet.octopart.com:443/RC0603FR-07330RL-Yageo-datasheet-118562.pdf?src-supplier=DigiKey; ComponentLink18URL: http://sigma.octopart.com:80/conflict_mineral_statement/Yageo-company-3.pdf?src-supplier=Compliance+Statements; ComponentLink18Description: http://sigma.octopart.com:80/conflict_mineral_statement/Yageo-company-3.pdf?src-supplier=Compliance+Statements; ComponentLink19URL: http://sigma.octopart.com:80/rohs_statement/Yageo-company-2.pdf?src-supplier=Compliance+Statements; ComponentLink19Description: http://sigma.octopart.com:80/rohs_statement/Yageo-company-2.pdf?src-supplier=Compliance+Statements
R2 = CRCW040213K3FKED: CRCW FIXED RESISTOR 0402 (1005Metric) Chip Resistor ±1% ±100ppm/C 13.3kOhm 0.063W 1/16W; Manufacturer: Vishay; Max Power Dissipation: 63mW; Value: 13.3kΩ; Temperature Coefficient: 100ppm/°C; Voltage Rating: 50V; Supplier: Farnell; Supplier Part Number: 4139115; Manufacturer Part Number: CRCW040213K3FKED; RoHS: Compliant; Category: Chip SMD Resistors; Stock: 6850; Pricing: 10=0,0192, 100=0,0139, 500=0,0112, 2500=0,0093, 5000=0,0091 (EUR); Case/Package: 0402; Case Code (Imperial): 0402; China RoHS: Non-Compliant; Composition: Thick Film; Contact Plating: Tin; Depth: 500µm; Features: Automotive AEC-Q200; Height: 350µm; Lead Free: Lead Free; Length: 1mm; Lifecycle Status: Production; Max Operating Temperature: 155°C; Military Standard: Not; Min Operating Temperature: -55°C; Mounting Technology: Surface Mount; Pins: 2; Number of Terminals: 2; Number of Terminations: 2; Power Dissipation: 63mW; Power Rating: 63mW; Radiation Hardening: No; REACH SVHC: Yes; Schedule B: 8533210045, 8533210045|8533210045|8533210045|8533210045|8533210045|8533210045|8533210045|8533210045|8533210045|8533210045|8533210045|8533210045|8533210045|8533210045|8533210045|8533210045|8533210045|8533210045|8533210045|8533210045|8533210045|8533210045|8533210045|85; Termination: SMD/SMT; Tolerance: 1%; Voltage Rating (DC): 50V; Weight: 652.039032µg; Width: 500µm; Working Voltage: 50V; ComponentLink1URL: https://datasheet.octopart.com:443/CRCW040213K3FKED-Vishay-datasheet-175423584.pdf?src-supplier=IHS; ComponentLink1Description: https://datasheet.octopart.com:443/CRCW040213K3FKED-Vishay-datasheet-175423584.pdf?src-supplier=IHS; ComponentLink2URL: https://datasheet.octopart.com:443/CRCW040213K3FKED-Vishay-datasheet-190005712.pdf?src-supplier=TME; ComponentLink2Description: https://datasheet.octopart.com:443/CRCW040213K3FKED-Vishay-datasheet-190005712.pdf?src-supplier=TME; ComponentLink3URL: https://datasheet.octopart.com:443/CRCW040213K3FKED-Vishay-datasheet-83961561.pdf?src-supplier=Farnell; ComponentLink3Description: https://datasheet.octopart.com:443/CRCW040213K3FKED-Vishay-datasheet-83961561.pdf?src-supplier=Farnell; ComponentLink4URL: https://datasheet.octopart.com:443/CRCW040213K3FKED-Vishay-datasheet-62317933.pdf?src-supplier=Farnell; ComponentLink4Description: https://datasheet.octopart.com:443/CRCW040213K3FKED-Vishay-datasheet-62317933.pdf?src-supplier=Farnell; ComponentLink5URL: https://datasheet.octopart.com:443/CRCW040213K3FKED-Vishay-datasheet-14722531.pdf?src-supplier=Farnell; ComponentLink5Description: https://datasheet.octopart.com:443/CRCW040213K3FKED-Vishay-datasheet-14722531.pdf?src-supplier=Farnell; ComponentLink6URL: https://datasheet.octopart.com:443/CRCW040213K3FKED-Vishay-datasheet-5300368.pdf?src-supplier=Farnell; ComponentLink6Description: https://datasheet.octopart.com:443/CRCW040213K3FKED-Vishay-datasheet-5300368.pdf?src-supplier=Farnell; ComponentLink7URL: https://datasheet.octopart.com:443/CRCW040213K3FKED-Vishay-datasheet-66077789.pdf?src-supplier=Newark; ComponentLink7Description: https://datasheet.octopart.com:443/CRCW040213K3FKED-Vishay-datasheet-66077789.pdf?src-supplier=Newark; ComponentLink8URL: https://datasheet.octopart.com:443/CRCW040213K3FKED-Vishay-datasheet-11516975.pdf?src-supplier=Newark; ComponentLink8Description: https://datasheet.octopart.com:443/CRCW040213K3FKED-Vishay-datasheet-11516975.pdf?src-supplier=Newark; ComponentLink9URL: https://datasheet.octopart.com:443/CRCW040213K3FKED-Vishay-datasheet-41302739.pdf?src-supplier=Newark; ComponentLink9Description: https://datasheet.octopart.com:443/CRCW040213K3FKED-Vishay-datasheet-41302739.pdf?src-supplier=Newark; ComponentLink10URL: https://datasheet.octopart.com:443/CRCW040213K3FKED-Vishay-datasheet-33013972.pdf?src-supplier=Newark; ComponentLink10Description: https://datasheet.octopart.com:443/CRCW040213K3FKED-Vishay-datasheet-33013972.pdf?src-supplier=Newark; ComponentLink11URL: https://datasheet.octopart.com:443/CRCW040213K3FKED-Vishay-datasheet-21226360.pdf?src-supplier=Newark; ComponentLink11Description: https://datasheet.octopart.com:443/CRCW040213K3FKED-Vishay-datasheet-21226360.pdf?src-supplier=Newark; ComponentLink12URL: https://datasheet.octopart.com:443/CRCW040213K3FKED-Vishay-datasheet-10882403.pdf?src-supplier=element14+APAC; ComponentLink12Description: https://datasheet.octopart.com:443/CRCW040213K3FKED-Vishay-datasheet-10882403.pdf?src-supplier=element14+APAC; ComponentLink13URL: https://datasheet.octopart.com:443/CRCW040213K3FKED-Vishay-datasheet-137113250.pdf?src-supplier=X-ON; ComponentLink13Description: https://datasheet.octopart.com:443/CRCW040213K3FKED-Vishay-datasheet-137113250.pdf?src-supplier=X-ON; ComponentLink14URL: https://datasheet.octopart.com:443/CRCW040213K3FKED-Vishay-datasheet-62316122.pdf?src-supplier=Future+Electronics; ComponentLink14Description: https://datasheet.octopart.com:443/CRCW040213K3FKED-Vishay-datasheet-62316122.pdf?src-supplier=Future+Electronics; ComponentLink15URL: https://datasheet.octopart.com:443/CRCW040213K3FKED-Vishay-datasheet-12519820.pdf?src-supplier=Future+Electronics; ComponentLink15Description: https://datasheet.octopart.com:443/CRCW040213K3FKED-Vishay-datasheet-12519820.pdf?src-supplier=Future+Electronics; ComponentLink16URL: https://datasheet.octopart.com:443/CRCW040213K3FKED-Vishay-Dale-datasheet-47688880.pdf?src-supplier=RS+(Formerly+Allied+Electronics); ComponentLink16Description: https://datasheet.octopart.com:443/CRCW040213K3FKED-Vishay-Dale-datasheet-47688880.pdf?src-supplier=RS+(Formerly+Allied+Electronics); ComponentLink17URL: https://datasheet.octopart.com:443/CRCW040213K3FKED-Vishay-datasheet-12001583.pdf?src-supplier=RS+(Formerly+Allied+Electronics); ComponentLink17Description: https://datasheet.octopart.com:443/CRCW040213K3FKED-Vishay-datasheet-12001583.pdf?src-supplier=RS+(Formerly+Allied+Electronics); ComponentLink18URL: https://datasheet.octopart.com:443/CRCW040213K3FKED-Vishay-datasheet-5306405.pdf?src-supplier=RS+(Formerly+Allied+Electronics); ComponentLink18Description: https://datasheet.octopart.com:443/CRCW040213K3FKED-Vishay-datasheet-5306405.pdf?src-supplier=RS+(Formerly+Allied+Electronics); ComponentLink19URL: https://datasheet.octopart.com:443/CRCW040213K3FKED-Vishay-datasheet-11540273.pdf?src-supplier=Arrow+Electronics; ComponentLink19Description: https://datasheet.octopart.com:443/CRCW040213K3FKED-Vishay-datasheet-11540273.pdf?src-supplier=Arrow+Electronics; ComponentLink20URL: https://datasheet.octopart.com:443/CRCW040213K3FKED-Vishay-datasheet-8445837.pdf?src-supplier=element14; ComponentLink20Description: https://datasheet.octopart.com:443/CRCW040213K3FKED-Vishay-datasheet-8445837.pdf?src-supplier=element14; ComponentLink21URL: https://datasheet.octopart.com:443/CRCW040213K3FKED-Vishay-datasheet-5377255.pdf?src-supplier=Garrett; ComponentLink21Description: https://datasheet.octopart.com:443/CRCW040213K3FKED-Vishay-datasheet-5377255.pdf?src-supplier=Garrett; ComponentLink22URL: https://datasheet.octopart.com:443/CRCW040213K3FKED-Vishay-datasheet-148188.pdf?src-supplier=Garrett; ComponentLink22Description: https://datasheet.octopart.com:443/CRCW040213K3FKED-Vishay-datasheet-148188.pdf?src-supplier=Garrett; ComponentLink23URL: https://datasheet.octopart.com:443/CRCW040213K3FKED-Vishay-datasheet-42367.pdf?src-supplier=Garrett; ComponentLink23Description: https://datasheet.octopart.com:443/CRCW040213K3FKED-Vishay-datasheet-42367.pdf?src-supplier=Garrett; ComponentLink24URL: http://sigma.octopart.com:80/rohs_statement/Vishay-company-15.pdf?src-supplier=Compliance+Statements; ComponentLink24Description: http://sigma.octopart.com:80/rohs_statement/Vishay-company-15.pdf?src-supplier=Compliance+Statements